# Altium schematic sheet RAM-k4s561632h-uc75.SchDoc
size A4; SheetNumber: 6; SheetTotal: 8
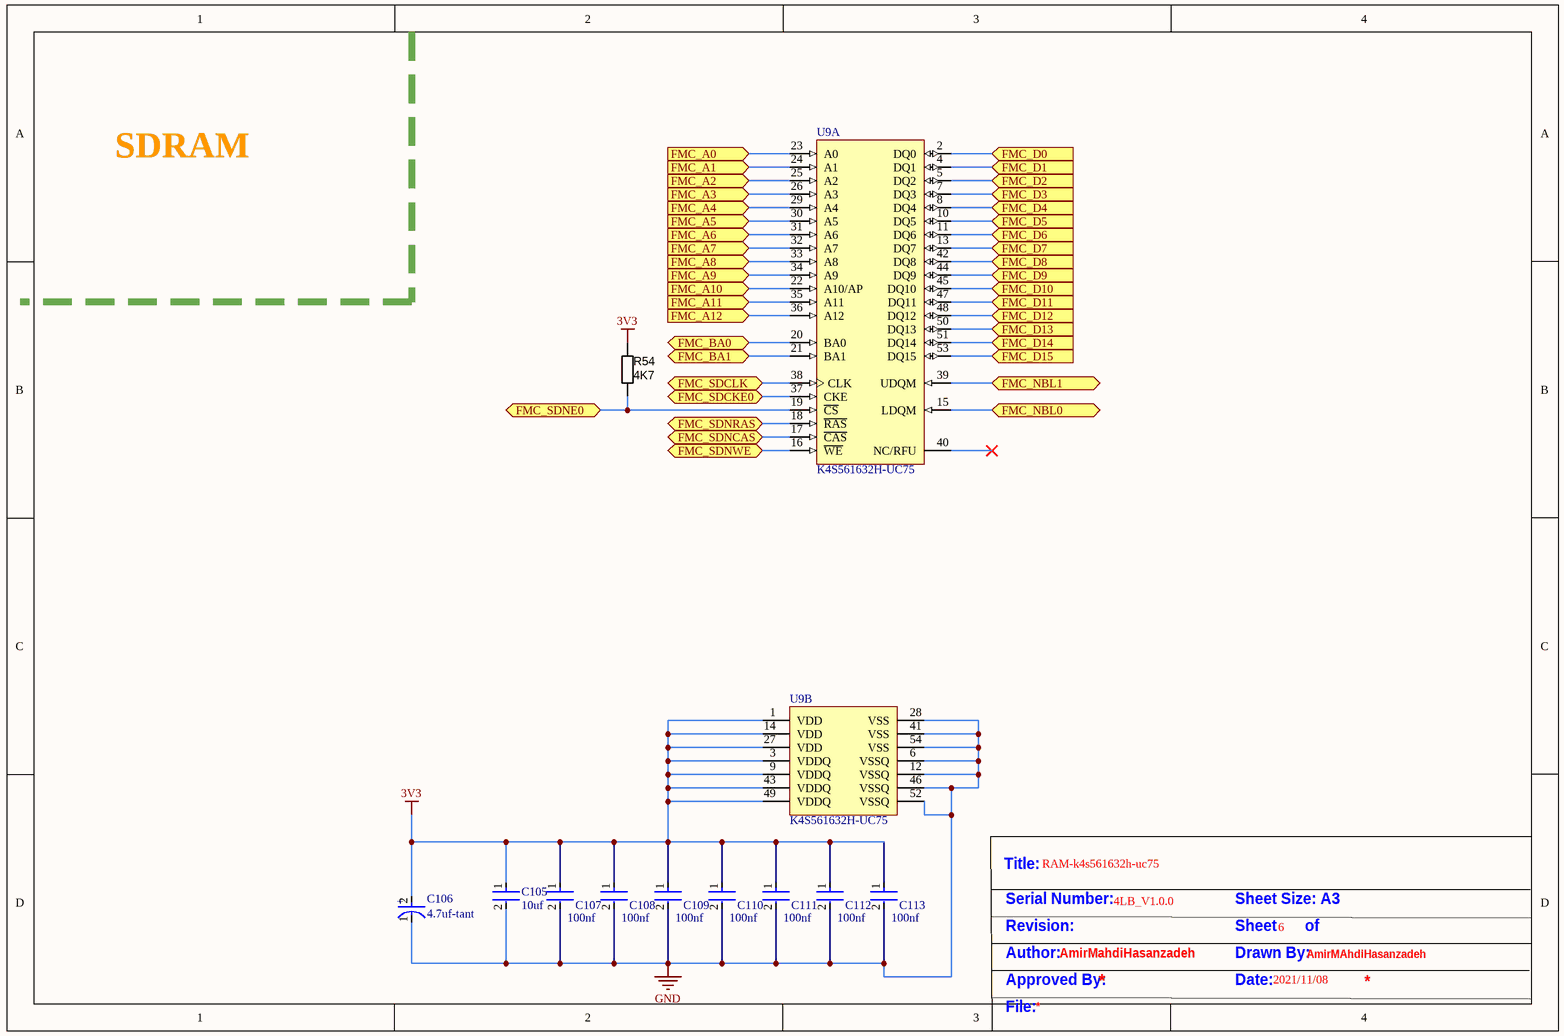
[diagram p0: RAM-k4s561632h-uc75.SchDoc]

## Parts
C105  10uf  [FP-C3216-160-0_2-IPC_A]
C106  4.7uf-tant  [FP-T491A475K016AT-MFG]
C107  100nf  [FP-CGA3E-0_3-0_1-IPC_A]
C108  100nf  [FP-CGA3E-0_3-0_1-IPC_A]
C109  100nf  [FP-CGA3E-0_3-0_1-IPC_A]
C110  100nf  [FP-CGA3E-0_3-0_1-IPC_A]
C111  100nf  [FP-CGA3E-0_3-0_1-IPC_A]
C112  100nf  [FP-CGA3E-0_3-0_1-IPC_A]
C113  100nf  [FP-CGA3E-0_3-0_1-IPC_A]
R54  value 4K7  [RESC1608X55N]  (hidden comment: Thick Film)
U9  K4S561632H-UC75  [SAMS-TSOP-54_L]  (parts A,B of 2)

## Ports
FMC_A0 (in), FMC_A1 (in), FMC_A2 (in), FMC_A3 (in), FMC_A4 (in), FMC_A5 (in), FMC_A6 (in), FMC_A7 (in), FMC_A8 (in), FMC_A9 (in), FMC_A10 (in), FMC_A11 (in), FMC_A12 (in), FMC_BA0 (bidir), FMC_BA1 (bidir), FMC_D0 (in), FMC_D1 (in), FMC_D2 (in), FMC_D3 (in), FMC_D4 (in), FMC_D5 (in), FMC_D6 (in), FMC_D7 (in), FMC_D8 (in), FMC_D9 (in), FMC_D10 (in), FMC_D11 (in), FMC_D12 (in), FMC_D13 (in), FMC_D14 (in), FMC_D15 (in), FMC_NBL0 (bidir), FMC_NBL1 (bidir), FMC_SDCKE0 (bidir), FMC_SDCLK (bidir), FMC_SDNCAS (bidir), FMC_SDNE0 (bidir), FMC_SDNRAS (bidir), FMC_SDNWE (bidir)

## Nets
3V3: C105.1 C106.2(A) C107.1 C108.1 C109.1 C110.1 C111.1 C112.1 C113.1 R54.1 U9.1(VDD) U9.3(VDDQ) U9.9(VDDQ) U9.14(VDD) U9.27(VDD) U9.43(VDDQ) U9.49(VDDQ)
GND: C105.2 C106.1(C) C107.2 C108.2 C109.2 C110.2 C111.2 C112.2 C113.2 U9.6(VSSQ) U9.12(VSSQ) U9.28(VSS) U9.41(VSS) U9.46(VSSQ) U9.52(VSSQ) U9.54(VSS)
FMC_A0: U9.23(A0) ; port FMC_A0
FMC_A1: U9.24(A1) ; port FMC_A1
FMC_A2: U9.25(A2) ; port FMC_A2
FMC_A3: U9.26(A3) ; port FMC_A3
FMC_A4: U9.29(A4) ; port FMC_A4
FMC_A5: U9.30(A5) ; port FMC_A5
FMC_A6: U9.31(A6) ; port FMC_A6
FMC_A7: U9.32(A7) ; port FMC_A7
FMC_A8: U9.33(A8) ; port FMC_A8
FMC_A9: U9.34(A9) ; port FMC_A9
FMC_A10: U9.22(A10/AP) ; port FMC_A10
FMC_A11: U9.35(A11) ; port FMC_A11
FMC_A12: U9.36(A12) ; port FMC_A12
FMC_BA0: U9.20(BA0) ; port FMC_BA0
FMC_BA1: U9.21(BA1) ; port FMC_BA1
FMC_D0: U9.2(DQ0) ; port FMC_D0
FMC_D1: U9.4(DQ1) ; port FMC_D1
FMC_D2: U9.5(DQ2) ; port FMC_D2
FMC_D3: U9.7(DQ3) ; port FMC_D3
FMC_D4: U9.8(DQ4) ; port FMC_D4
FMC_D5: U9.10(DQ5) ; port FMC_D5
FMC_D6: U9.11(DQ6) ; port FMC_D6
FMC_D7: U9.13(DQ7) ; port FMC_D7
FMC_D8: U9.42(DQ8) ; port FMC_D8
FMC_D9: U9.44(DQ9) ; port FMC_D9
FMC_D10: U9.45(DQ10) ; port FMC_D10
FMC_D11: U9.47(DQ11) ; port FMC_D11
FMC_D12: U9.48(DQ12) ; port FMC_D12
FMC_D13: U9.50(DQ13) ; port FMC_D13
FMC_D14: U9.51(DQ14) ; port FMC_D14
FMC_D15: U9.53(DQ15) ; port FMC_D15
FMC_NBL0: U9.15(LDQM) ; port FMC_NBL0
FMC_NBL1: U9.39(UDQM) ; port FMC_NBL1
FMC_SDCKE0: U9.37(CKE) ; port FMC_SDCKE0
FMC_SDCLK: U9.38(CLK) ; port FMC_SDCLK
FMC_SDNCAS: U9.17(~{CAS}) ; port FMC_SDNCAS
FMC_SDNE0: R54.2 U9.19(~{CS}) ; port FMC_SDNE0
FMC_SDNRAS: U9.18(~{RAS}) ; port FMC_SDNRAS
FMC_SDNWE: U9.16(~{WE}) ; port FMC_SDNWE

Not connected (* = marked no-connect by the designer): U9 40(NC/RFU)*

## Notes on the sheet
- SDRAM
- Title:
- Serial Number:
- RAM-k4s561632h-uc75
- 4LB_V1.0.0
- Sheet Size: A3
- Author:
- Approved By:
- Revision:
- AmirMahdiHasanzadeh
- Date:
- Sheet       of
- Drawn By:
- 2021/11/08
- 6
- AmirMAhdiHasanzadeh
- File:
- (in symbol CMP-2000-07188-2) +

## Library data of the parts
C105 = CMP-2000-06045-2: Multilayer Ceramic Capacitors 10uF ±10% 50V X5R SMD 1206; Min Operating Temperature: -55°C; Weight: 0.000571oz; Tolerance: 10%; Lead Free: Lead Free; REACH SVHC: No SVHC; Dielectric Material: Ceramic; Termination: SMD/SMT; Radiation Hardening: No; Case Code (Metric): 3216; Max Operating Temperature: 85°C; Voltage Rating (DC): 50V; Packaging: Tape and Reel; Height: 1.6mm; Voltage: 50V; Dielectric: X5R; Mount: Surface Mount; Voltage Rating: 50V; Capacitance: 10uF; Length: 3.2mm; RoHS Compliant: Yes; Thickness: 0.071inch; Depth: 1.6mm; Width: 0.063inch; Case/Package: 1206; Series: C; Package Quantity: 1; Resistor Type: Ceramic; Case Code (Imperial): 1206; Construction: Flat
C106 = CMP-2000-07188-2: CAP TANT 4.7UF 10% 16V 1206; Polarity: Polar; Life (Hours): 2000Hour; Ripple Current: 137mA; ESR (Equivalent Series Resistance): 4R; Dielectric Material: Tantalum; Leakage Current: 800nA; Dissipation Factor: 6%; Voltage Rating: 16V; Case Code (Imperial): 1206; Radiation Hardening: No; Width: 1.6mm; Case/Package: 1206; Mount: Surface Mount; Voltage Rating (DC): 16V; Max Operating Temperature: 125°C; Case Code (Metric): 3216; Features: General Purpose; Number of Pins: 2; Depth: 1.6mm; Length: 3.2mm; Package Quantity: 1; Termination: SMD/SMT; Construction: Flat; Height: 1.6mm; RoHS Compliant: Yes; Tolerance: 10%; Min Operating Temperature: -55°C; Packaging: Tape and Reel; Capacitance: 4.7uF; Lead Free: Lead Free; Series: T491; REACH SVHC: No SVHC; Height - Seated (Max): 0.071inch; Voltage: 16V
C107-C113 = CMP-2000-07546-2: Cap Ceramic 100nF 50V X7R 10% Pad SMD 0603 +125°C Automotive T/R; Weight: 7.1E-05oz; Composition: Ceramic; Max Operating Temperature: 125°C; Termination: SMD/SMT; Dielectric: X7R; Length: 1.6mm; Package Quantity: 1; REACH SVHC: No SVHC; Lead Free: Lead Free; Case Code (Metric): 1608; Min Operating Temperature: -55°C; Packaging: Tape and Reel; Tolerance: 10%; Voltage Rating: 50V; Case Code (Imperial): 0603; Capacitance: 100nF; Case/Package: 0603; Voltage Rating (DC): 50V; Depth: 0.8mm; Radiation Hardening: No; Ratings: AEC-Q200; Mount: Surface Mount; Voltage: 50V; Thickness: 0.035inch; Width: 0.8mm; Height: 0.8mm
R54 = RES_4K7_0603_5%: Resistor SMD chip 4.7k Ohm 0.1W 5% 0603; Manufacturer 1: Vishay/Dale; Manufacturer Part Number 1: CRCW06034K70JNEA; Ratings: 1/10 W; SCDType: spec; Package / Case: 0603 (1608 metric); Tolerance: ±5%; Material: Thick Film; Supplier 1: Digi-Key; Supplier Part Number 1: 541-4.7KGCT-ND
U9 = CMP-2000-06510-1: H-Die SDRAM Specification, 256 Mbits, 130 mA, 3.3 V, 0 to 70 degC, 54-Pin TSOP, RoHS; Manufacturer: Samsung Electro-Mechanics; Datasheet URL: http://datasheet.octopart.com/K4S560832H-UC75-Samsung-datasheet-13141326.pdf; Mounting Technology: SurfaceMount; Datasheet Version: Rev. 1.0, 10/2005; Package Reference: TSOP-54; Manufacturer URL: http://www.samsungsem.com/global/index.jsp; Package Description: 54-Pin Thin Small Outline Package, Body 22.22 x 10.16 mm, Pitch 0.8 mm